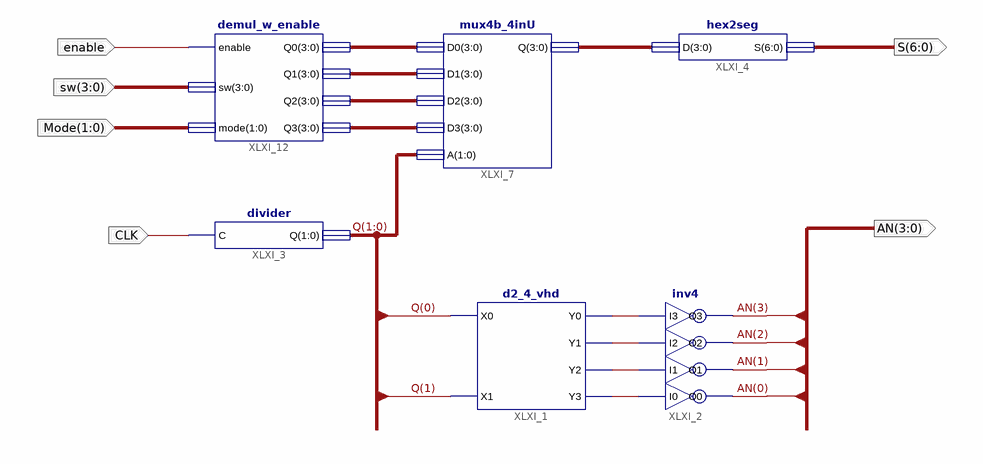
[diagram p0: schematic sheet 1]
// Xilinx ISE schematic main.sch (spartan6) as structural Verilog: 6 symbols, 6 ports
module main (
  input  CLK,
  input  [1:0] Mode,
  input  [3:0] sw,
  input  enable,
  output [3:0] AN,
  output [6:0] S
);

  wire XLXN_8, XLXN_9, XLXN_10, XLXN_11;
  wire [1:0] Q;
  wire [3:0] XLXN_32, XLXN_45, XLXN_46, XLXN_47, XLXN_48;

  d2_4_vhd XLXI_1 (.X0(Q[0]), .X1(Q[1]), .Y0(XLXN_8), .Y1(XLXN_9), .Y2(XLXN_10), .Y3(XLXN_11));
  inv4 XLXI_2 (.I0(XLXN_11), .I1(XLXN_10), .I2(XLXN_9), .I3(XLXN_8), .O0(AN[0]), .O1(AN[1]), .O2(AN[2]), .O3(AN[3]));
  divider XLXI_3 (.C(CLK), .Q(Q));
  mux4b_4inU XLXI_7 (.D0(XLXN_45), .D1(XLXN_46), .D2(XLXN_47), .D3(XLXN_48), .A(Q), .Q(XLXN_32));
  hex2seg XLXI_4 (.D(XLXN_32), .S(S));
  demul_w_enable XLXI_12 (
    .enable(enable), .sw(sw), .mode(Mode), .Q0(XLXN_45), .Q1(XLXN_46), .Q2(XLXN_47), .Q3(XLXN_48));
endmodule
